# Altium schematic sheet DLP.SchDoc
size A2
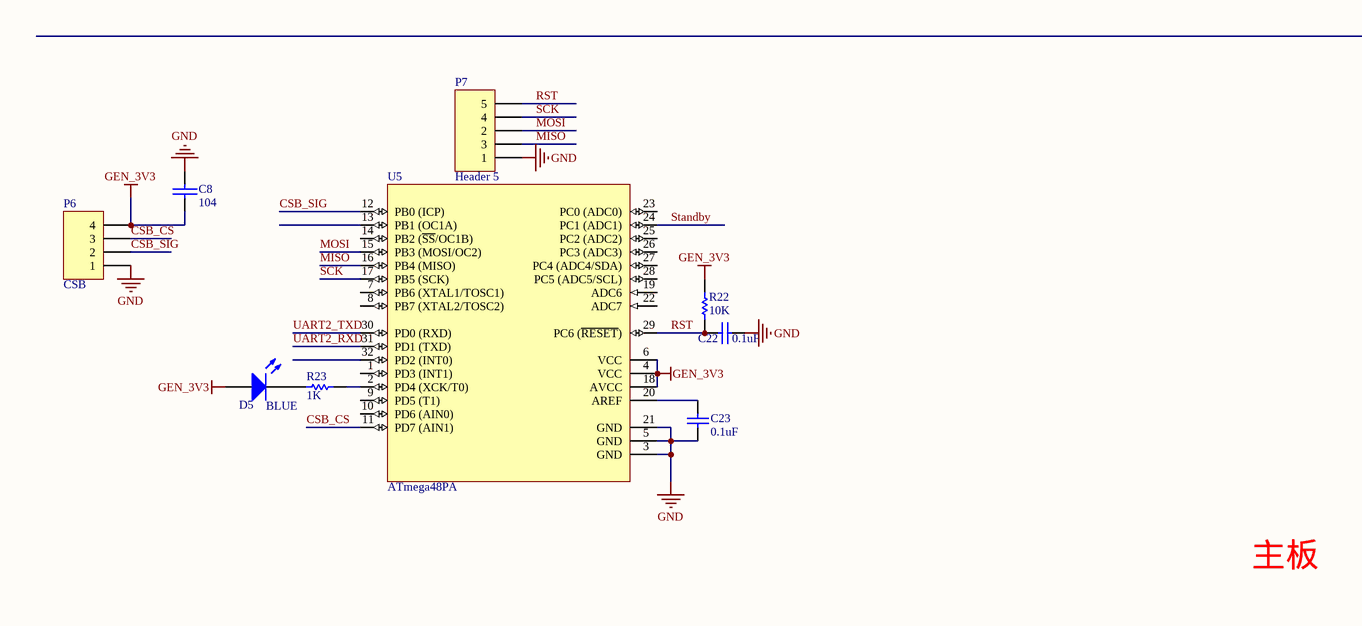
[diagram p0: DLP.SchDoc, top left]
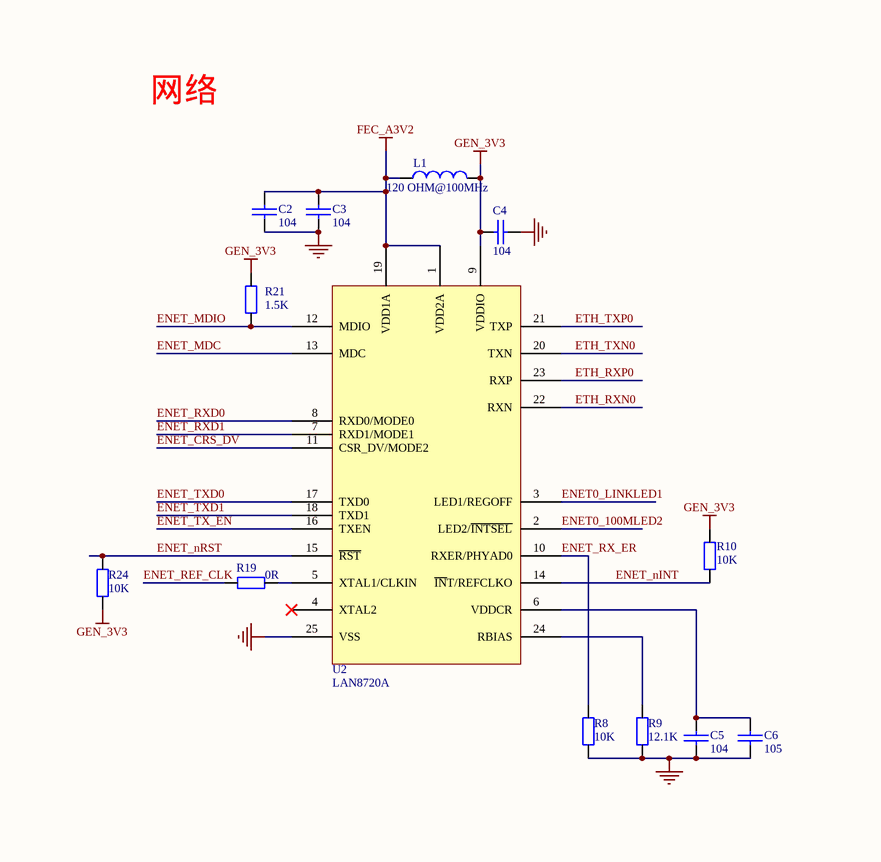
[diagram p1: DLP.SchDoc, top right]
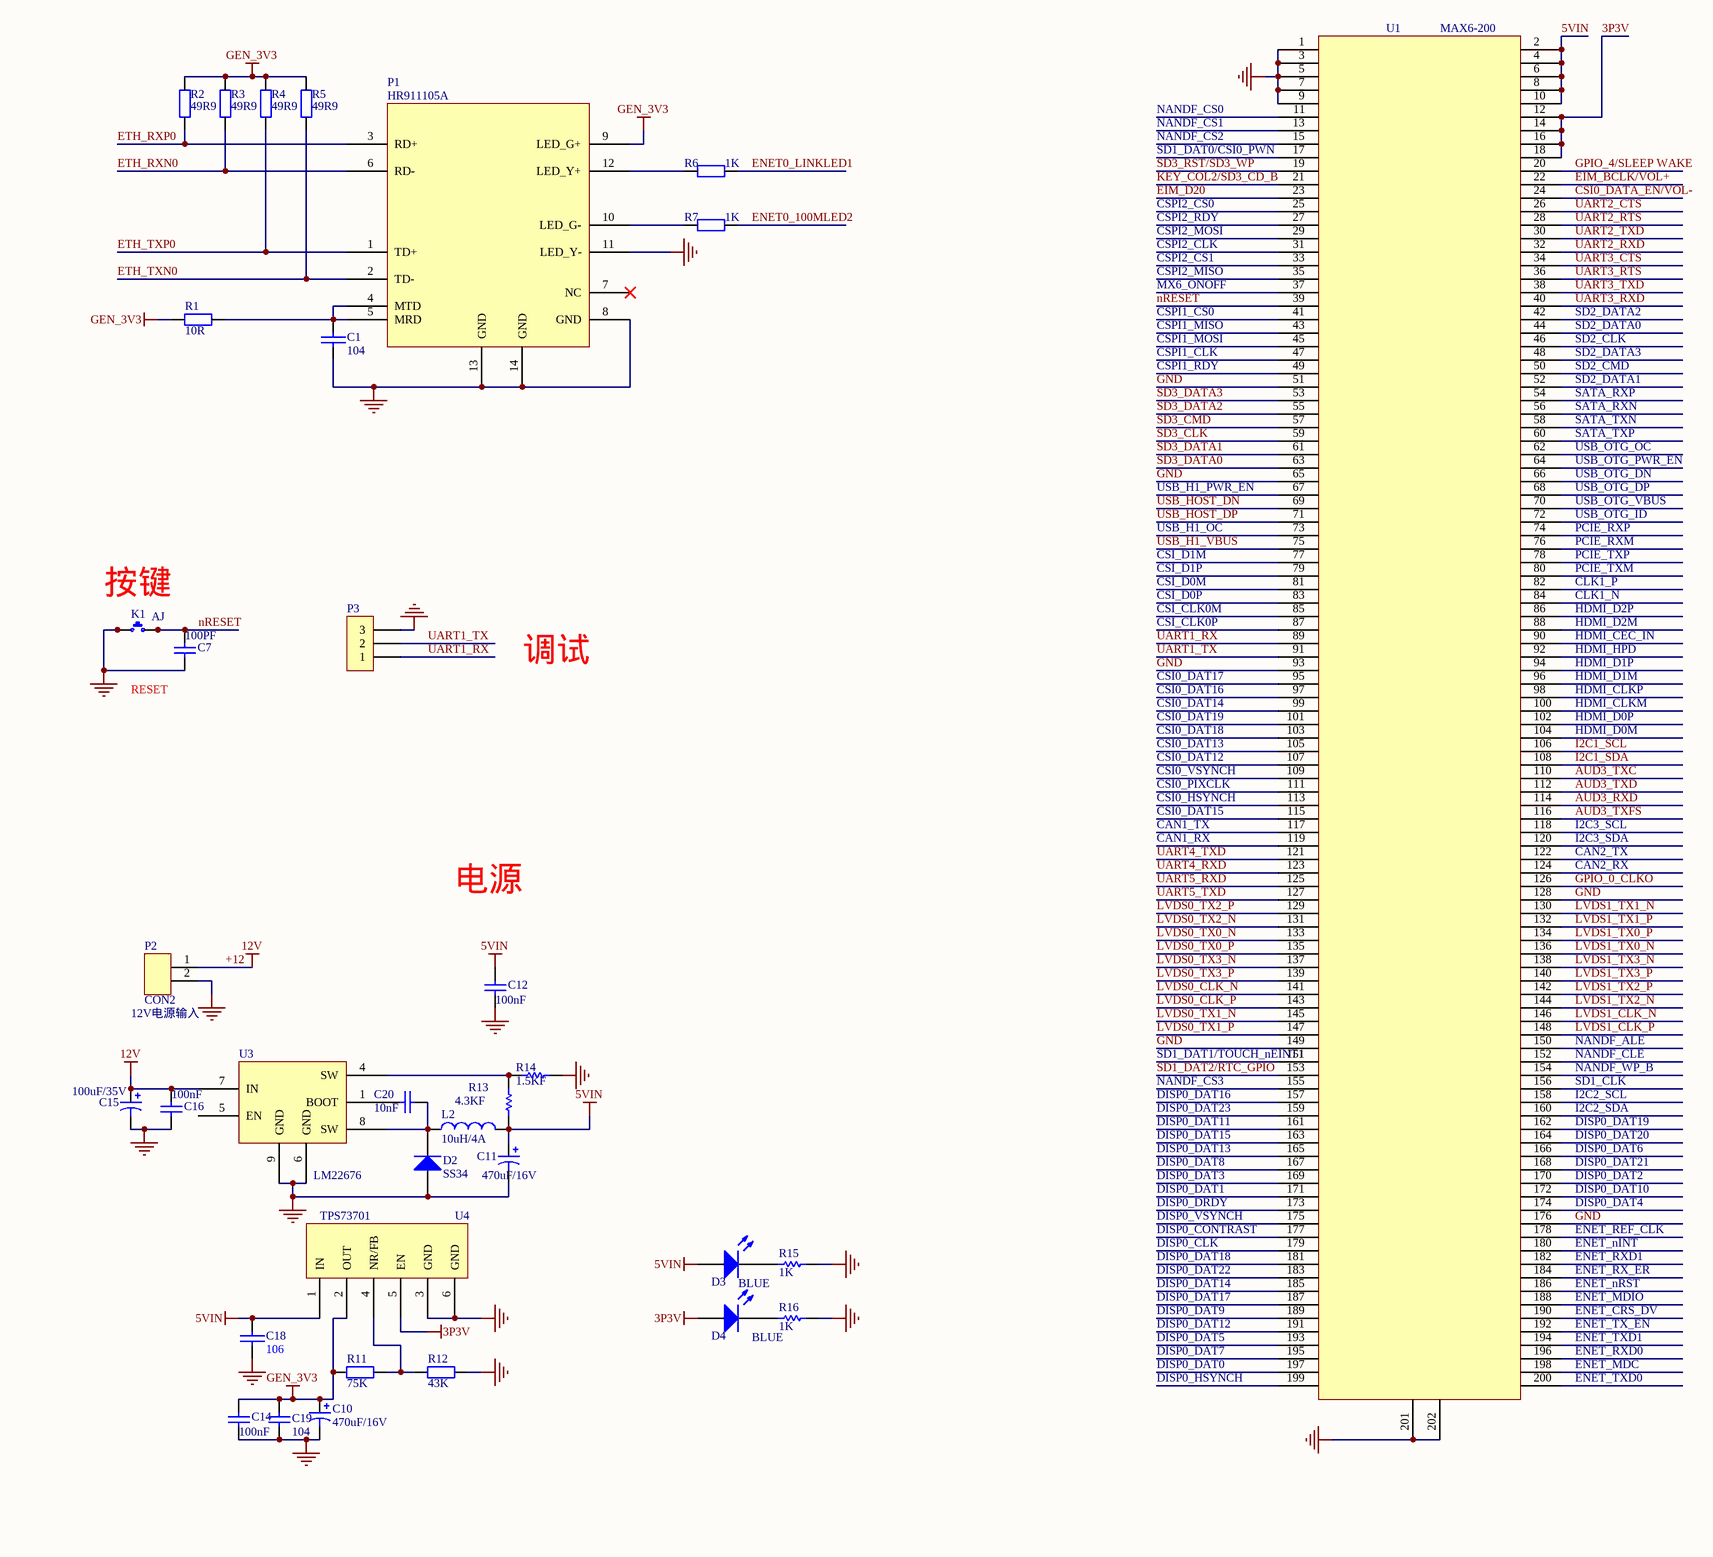
[diagram p2: DLP.SchDoc, bottom left]
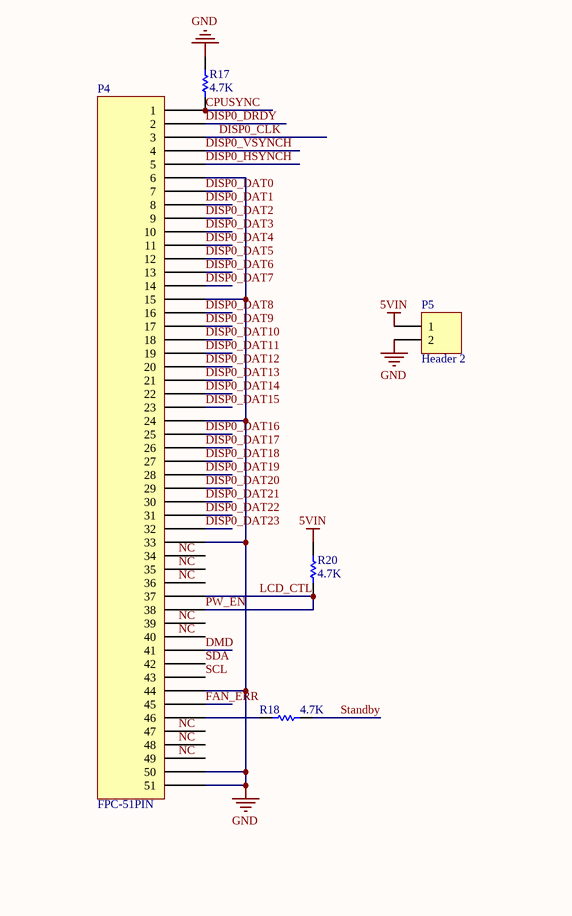
[diagram p3: DLP.SchDoc, bottom right]

## Parts
C1  104  [0603]
C2  104  [0603]
C3  104  [0603]
C4  104  [0603]
C5  104  [0603]
C6  105  [0603]
C7  100PF  [0603]
C8  104  [0603]
C10  470uF/16V  [3216[1206]]
C11  470uF/16V  [C6.3*12]
C12  100nF  [0603]
C14  100nF  [0603]
C15  100uF/35V  [C6.3*12]
C16  100nF  [0603]
C18  106  [C1206]
C19  104  [0603]
C20  10nF  [0603]
C22  value 0.1uF  [0603]  (hidden comment: Cap)
C23  value 0.1uF  [0603]  (hidden comment: Cap)
D2  SS34  [SMA]
D3  BLUE  [0603-LED]
D4  BLUE  [0603-LED]
D5  BLUE  [0603-LED]
K1  AJ  [4*4*1.5]
L1  120 OHM@100MHz  [0603]
L2  10uH/4A  [8040]
P1  HR911105A  [HR911105A]
P2  CON2  [PH2.0-2P]
P3  (no value)  [HDR1X3]
P4  FPC-51PIN  [FH26-51S-0.3SHW]
P5  Header 2  [PH2.0-2P]
P6  CSB  [HDR1X4]
P7  Header 5  [HDR1X5]
R1  10R  [0603]
R2  49R9  [0603]
R3  49R9  [0603]
R4  49R9  [0603]
R5  49R9  [0603]
R6  1K  [0603]
R7  1K  [0603]
R8  10K  [0603]
R9  12.1K  [0603]
R10  10K  [0603]
R11  75K  [0603]
R12  43K  [0603]
R13  4.3KF  [0603]
R14  1.5KF  [0603]
R15  1K  [0603]
R16  1K  [0603]
R17  value 4.7K  [0603]  (hidden comment: Res1)
R18  value 4.7K  [0603]  (hidden comment: Res1)
R19  0R  [0603]
R20  value 4.7K  [0603]  (hidden comment: Res1)
R21  1.5K  [0603R]
R22  value 10K  [0603]  (hidden comment: Res1)
R23  1K  [0603]
R24  10K  [0603]
U1  MAX6-200  [SO-DIMM 200]
U2  LAN8720A  [QFN24_4X4MM]
U3  LM22676  [SO-8HP]
U4  TPS73701  [SOT223-6]
U5  ATmega48PA  [32A_M]

## Nets
3P3V: D4.1(A) U1.12 U1.14 U1.16 U1.18 U4.5(EN)
5VIN: C11.1 C12.2 C18.1 D3.1(A) L2.2 P5.1 R13.2 R20.1 U1.2 U1.4 U1.6 U1.8 U1.10 U4.1(IN)
+12: C15.1 C16.2 P2.1 U3.7(IN)  [also labelled 12V]
FEC_A3V2: C2.1 C3.1 L1.1 U2.1(VDD2A) U2.19(VDD1A)
GEN_3V3: C4.2 C8.2 C10.1 C14.2 C19.2 D5.1(A) L1.2 P1.9(LED_G+) P6.4 R1.2 R2.2 R3.2 R4.2 R5.2 R10.2 R11.2 R21.2 R22.2 R24.1 U2.9(VDDIO) U4.2(OUT) U5.4(VCC) U5.6(VCC) U5.18(AVCC)
GND: C1.2 C2.2 C3.2 C4.1 C5.2 C6.2 C7.1 C8.1 C10.2 C11.2 C12.1 C14.1 C15.2 C16.1 C18.2 C19.1 C22.2 C23.2 D2.1(A) K1.1 K1.2 P1.8(GND) P1.11(LED_Y-) P1.13(GND) P1.14(GND) P2.2 P3.3 P4.6 P4.15 P4.24 P4.33 P4.44 P4.50 P4.51 P5.2 P6.1 P7.1 R8.1 R9.1 R12.2 R14.2 R15.1 R16.1 R17.1 U1.1 U1.3 U1.5 U1.7 U1.9 U1.51 U1.65 U1.93 U1.128 U1.149 U1.176 U1.201 U1.202 U2.25(VSS) U3.6(GND) U3.9(GND) U4.3(GND) U4.6(GND) U5.3(GND) U5.5(GND) U5.21(GND)
AUD3_RXD: U1.114
AUD3_TXC: U1.110
AUD3_TXD: U1.112
AUD3_TXFS: U1.116
CAN1_RX: U1.119
CAN1_TX: U1.117
CAN2_RX: U1.124
CAN2_TX: U1.122
CLK1_N: U1.84
CLK1_P: U1.82
CPUSYNC: P4.1 R17.2
CSB_CS: P6.3 U5.11(PD7_(AIN1))
CSB_SIG: P6.2 U5.12(PB0_(ICP))
CSI0_DAT12: U1.107
CSI0_DAT13: U1.105
CSI0_DAT14: U1.99
CSI0_DAT15: U1.115
CSI0_DAT16: U1.97
CSI0_DAT17: U1.95
CSI0_DAT18: U1.103
CSI0_DAT19: U1.101
CSI0_DATA_EN/VOL-: U1.24
CSI0_HSYNCH: U1.113
CSI0_PIXCLK: U1.111
CSI0_VSYNCH: U1.109
CSI_CLK0M: U1.85
CSI_CLK0P: U1.87
CSI_D0M: U1.81
CSI_D0P: U1.83
CSI_D1M: U1.77
CSI_D1P: U1.79
CSPI1_CLK: U1.47
CSPI1_CS0: U1.41
CSPI1_MISO: U1.43
CSPI1_MOSI: U1.45
CSPI1_RDY: U1.49
CSPI2_CLK: U1.31
CSPI2_CS0: U1.25
CSPI2_CS1: U1.33
CSPI2_MISO: U1.35
CSPI2_MOSI: U1.29
CSPI2_RDY: U1.27
DISP0_CLK: P4.3 U1.179
DISP0_CONTRAST: U1.177
DISP0_DAT0: P4.7 U1.197
DISP0_DAT1: P4.8 U1.171
DISP0_DAT2: P4.9 U1.170
DISP0_DAT3: P4.10 U1.169
DISP0_DAT4: P4.11 U1.174
DISP0_DAT5: P4.12 U1.193
DISP0_DAT6: P4.13 U1.166
DISP0_DAT7: P4.14 U1.195
DISP0_DAT8: P4.16 U1.167
DISP0_DAT9: P4.17 U1.189
DISP0_DAT10: P4.18 U1.172
DISP0_DAT11: P4.19 U1.161
DISP0_DAT12: P4.20 U1.191
DISP0_DAT13: P4.21 U1.165
DISP0_DAT14: P4.22 U1.185
DISP0_DAT15: P4.23 U1.163
DISP0_DAT16: P4.25 U1.157
DISP0_DAT17: P4.26 U1.187
DISP0_DAT18: P4.27 U1.181
DISP0_DAT19: P4.28 U1.162
DISP0_DAT20: P4.29 U1.164
DISP0_DAT21: P4.30 U1.168
DISP0_DAT22: P4.31 U1.183
DISP0_DAT23: P4.32 U1.159
DISP0_DRDY: P4.2 U1.173
DISP0_HSYNCH: P4.5 U1.199
DISP0_VSYNCH: P4.4 U1.175
DMD: P4.41
EIM_BCLK/VOL+: U1.22
EIM_D20: U1.23
ENET0_100MLED2: R7.2 U2.2(LED2/~{INTSEL})
ENET0_LINKLED1: R6.2 U2.3(LED1/REGOFF)
ENET_CRS_DV: U1.190 U2.11(CSR_DV/MODE2)
ENET_MDC: U1.198 U2.13(MDC)
ENET_MDIO: R21.1 U1.188 U2.12(MDIO)
ENET_nINT: R10.1 U1.180 U2.14(~{IN}T/REFCLKO)
ENET_nRST: R24.2 U1.186 U2.15(~{RST})
ENET_REF_CLK: R19.2 U1.178
ENET_RX_ER: R8.2 U1.184 U2.10(RXER/PHYAD0)
ENET_RXD0: U1.196 U2.8(RXD0/MODE0)
ENET_RXD1: U1.182 U2.7(RXD1/MODE1)
ENET_TX_EN: U1.192 U2.16(TXEN)
ENET_TXD0: U1.200 U2.17(TXD0)
ENET_TXD1: U1.194 U2.18(TXD1)
ETH_RXN0: P1.6(RD-) R3.1 U2.22(RXN)
ETH_RXP0: P1.3(RD+) R2.1 U2.23(RXP)
ETH_TXN0: P1.2(TD-) R5.1 U2.20(TXN)
ETH_TXP0: P1.1(TD+) R4.1 U2.21(TXP)
FAN_ERR: P4.45
GPIO_0_CLKO: U1.126
GPIO_4/SLEEP WAKE: U1.20
HDMI_CEC_IN: U1.90
HDMI_CLKM: U1.100
HDMI_CLKP: U1.98
HDMI_D0M: U1.104
HDMI_D0P: U1.102
HDMI_D1M: U1.96
HDMI_D1P: U1.94
HDMI_D2M: U1.88
HDMI_D2P: U1.86
HDMI_HPD: U1.92
I2C1_SCL: U1.106
I2C1_SDA: U1.108
I2C2_SCL: U1.158
I2C2_SDA: U1.160
I2C3_SCL: U1.118
I2C3_SDA: U1.120
KEY_COL2/SD3_CD_B: U1.21
LCD_CTL: P4.37 P4.38 R20.2  [also labelled PW_EN]
LVDS0_CLK_N: U1.141
LVDS0_CLK_P: U1.143
LVDS0_TX0_N: U1.133
LVDS0_TX0_P: U1.135
LVDS0_TX1_N: U1.145
LVDS0_TX1_P: U1.147
LVDS0_TX2_N: U1.131
LVDS0_TX2_P: U1.129
LVDS0_TX3_N: U1.137
LVDS0_TX3_P: U1.139
LVDS1_CLK_N: U1.146
LVDS1_CLK_P: U1.148
LVDS1_TX0_N: U1.136
LVDS1_TX0_P: U1.134
LVDS1_TX1_N: U1.130
LVDS1_TX1_P: U1.132
LVDS1_TX2_N: U1.144
LVDS1_TX2_P: U1.142
LVDS1_TX3_N: U1.138
LVDS1_TX3_P: U1.140
MISO: P7.3 U5.16(PB4_(MISO))
MOSI: P7.2 U5.15(PB3_(MOSI/OC2))
MX6_ONOFF: U1.37
NANDF_ALE: U1.150
NANDF_CLE: U1.152
NANDF_CS0: U1.11
NANDF_CS1: U1.13
NANDF_CS2: U1.15
NANDF_CS3: U1.155
NANDF_WP_B: U1.154
nRESET: C7.2 K1.3 K1.4 U1.39
PCIE_RXM: U1.76
PCIE_RXP: U1.74
PCIE_TXM: U1.80
PCIE_TXP: U1.78
RST: C22.1 P7.5 R22.1 U5.29(PC6_(~{RESET}))
SATA_RXN: U1.56
SATA_RXP: U1.54
SATA_TXN: U1.58
SATA_TXP: U1.60
SCK: P7.4 U5.17(PB5_(SCK))
SCL: P4.43
SD1_CLK: U1.156
SD1_DAT0/CSI0_PWN: U1.17
SD1_DAT1/TOUCH_nEINT1: U1.151
SD1_DAT2/RTC_GPIO: U1.153
SD2_CLK: U1.46
SD2_CMD: U1.50
SD2_DATA0: U1.44
SD2_DATA1: U1.52
SD2_DATA2: U1.42
SD2_DATA3: U1.48
SD3_CLK: U1.59
SD3_CMD: U1.57
SD3_DATA0: U1.63
SD3_DATA1: U1.61
SD3_DATA2: U1.55
SD3_DATA3: U1.53
SD3_RST/SD3_WP: U1.19
SDA: P4.42
Standby: R18.2 U5.24(PC1_(ADC1))
UART1_RX: P3.1 U1.89
UART1_TX: P3.2 U1.91
UART2_CTS: U1.26
UART2_RTS: U1.28
UART2_RXD: U1.32 U5.31(PD1_(TXD))
UART2_TXD: U1.30 U5.30(PD0_(RXD))
UART3_CTS: U1.34
UART3_RTS: U1.36
UART3_RXD: U1.40
UART3_TXD: U1.38
UART4_RXD: U1.123
UART4_TXD: U1.121
UART5_RXD: U1.125
UART5_TXD: U1.127
USB_H1_OC: U1.73
USB_H1_PWR_EN: U1.67
USB_H1_VBUS: U1.75
USB_HOST_DN: U1.69
USB_HOST_DP: U1.71
USB_OTG_DN: U1.66
USB_OTG_DP: U1.68
USB_OTG_ID: U1.72
USB_OTG_OC: U1.62
USB_OTG_PWR_EN: U1.64
USB_OTG_VBUS: U1.70
NetC1_1: C1.1 P1.4(MTD) P1.5(MRD) R1.1
NetC5_1: C5.1 C6.1 U2.6(VDDCR)
NetC20_1: C20.1 D2.2(K) L2.1 U3.8(SW)
NetC20_2: C20.2 U3.1(BOOT)
NetC23_1: C23.1 U5.20(AREF)
NetD3_2: D3.2(K) R15.2
NetD4_2: D4.2(K) R16.2
NetD5_2: D5.2(K) R23.2
NetP1_10: P1.10(LED_G-) R7.1
NetP1_12: P1.12(LED_Y+) R6.1
NetP4_46: P4.46 R18.1
NetR9_2: R9.2 U2.24(RBIAS)
NetR11_1: R11.1 R12.1 U4.4(NR/FB)
NetR13_1: R13.1 R14.1 U3.4(SW)
NetR19_1: R19.1 U2.5(XTAL1/CLKIN)
NetR23_1: R23.1 U5.2(PD4_(XCK/T0))

Not connected (* = marked no-connect by the designer): P1 7(NC)*; P4 34 35 36 39 40 47 48 49; U2 4(XTAL2)*; U3 5(EN); U5 1(PD3_(INT1)) 7(PB6_(XTAL1/TOSC1)) 8(PB7_(XTAL2/TOSC2)) 9(PD5_(T1)) 10(PD6_(AIN0)) 13(PB1_(OC1A)) 14(PB2_(~{SS}/OC1B)) 19(ADC6) 22(ADC7) 23(PC0_(ADC0)) 25(PC2_(ADC2)) 26(PC3_(ADC3)) 27(PC4_(ADC4/SDA)) 28(PC5_(ADC5/SCL)) 32(PD2_(INT0))

## Notes on the sheet
- 网络
- 主板
- (near K1) 按键
- RESET
- 调试
- 电源
- (near P2) 12V电源输入
- Labels drawn without touching a wire or pin: NC

## Library data of the parts
C1-C6 C8 C18 = CAP
C7 C12 C14 C16 C20 C22 C23 = Cap: Capacitor
  C22 C23: Published: 8-Jun-2000; LatestRevisionDate: 17-Jul-2002; LatestRevisionNote: Re-released for DXP Platform.; PackageReference: RAD-0.3; Publisher: Altium Limited
C10 C11 C15 = Cap Pol1: Polarized Capacitor (Radial)
C19 = Cap: Published: 8-Jun-2000; LatestRevisionDate: 17-Jul-2002; LatestRevisionNote: Re-released for DXP Platform.; PackageReference: RAD-0.3; Publisher: Altium Limited; PackageDescription: Radial Cap, Thru-Hole; 2 Leads; 0.3 in Pin Spacing
D2 = Diode 1N5408: 3 Amp Medium Power Silicon Rectifier Diode; DatasheetDocument: Aug-1984; ComponentLink1Description: Manufacturer Link; ComponentLink1URL: http://www.irf.com/
D3-D5 = LED2: Typical RED, GREEN, YELLOW, AMBER GaAs LED
K1 = KEY_1
L1 L2 = Inductor
P3 = CON3: Connector
P5 = Header 2: Header, 2-Pin; LatestRevisionDate: 17-Jul-2002; LatestRevisionNote: Re-released for DXP Platform.; Publisher: Altium Limited
P6 = Header 4: Header, 4-Pin; LatestRevisionDate: 17-Jul-2002; LatestRevisionNote: Re-released for DXP Platform.; Publisher: Altium Limited
P7 = Header 5: Header, 5-Pin; LatestRevisionDate: 17-Jul-2002; LatestRevisionNote: Re-released for DXP Platform.; Publisher: Altium Limited
R1-R10 R19 R21 R24 = RES
R11 R12 = Res2: Resistor; Published: 8-Jun-2000; LatestRevisionDate: 17-Jul-2002; LatestRevisionNote: Re-released for DXP Platform.; PackageReference: AXIAL-0.4; Publisher: Altium Limited; PackageDescription: Axial Device, Thru-Hole; 2 Leads; 0.4 in Pin Spacing
R13-R18 R20 R22 R23 = Res1: Resistor
  R17 R18 R20 R22: Published: 8-Jun-2000; LatestRevisionDate: 17-Jul-2002; LatestRevisionNote: Re-released for DXP Platform.; PackageReference: AXIAL-0.3; Publisher: Altium Limited
U4 = TPS737
U5 = ATmega8-16AC: 8-Bit AVR Microcontroller with 8K Bytes of In-System Programmable Flash Memory; Published: 17-Sep-2003; LatestRevisionDate: 13-Apr-2006; LatestRevisionNote: IPC-7351 Footprint Added.; DatasheetVersion: 2486H-AVR-09/02; PackageVersion: revB, Oct-2001; PackageReference: 32A; Publisher: Altium Limited; PackageDescription: 32-Pin Thin Quad Flat Pack 0.8 mm Pitch; Code_JEDEC: MS-026-ABA; ComponentLink1Description: Manufacturer Link; ComponentLink1URL: http://www.atmel.com; ComponentLink2Description: Datasheet; ComponentLink2URL: http://www.atmel.com/dyn/resources/prod_documents/doc2486.pdf